# Altium schematic sheet CAN Termination Connector.SchDoc
size A4
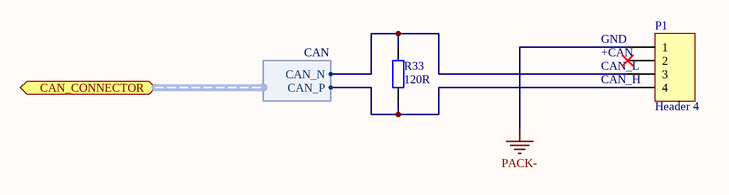
[diagram p0: CAN Termination Connector.SchDoc]

## Parts
P1  Header 4  [S04B-PASK-2]
R33  value 120R  [R0603]  (hidden comment: Res2)

## Ports
CAN_CONNECTOR (harness CAN)

## Harnesses
CAN: CAN_N, CAN_P

## Nets
PACK-: P1.1
NetP1_3: P1.3 R33.2 ; port CAN_CONNECTOR.CAN_N
NetP1_4: P1.4 R33.1 ; port CAN_CONNECTOR.CAN_P

Not connected (* = marked no-connect by the designer): P1 2*

## Notes on the sheet
- (near P1) GND
- (near P1) +CAN
- (near P1) CAN_L
- (near P1) CAN_H

## Library data of the parts
P1 = Header 4: Header, 4-Pin; LatestRevisionDate: 17-Jul-2002; LatestRevisionNote: Re-released for DXP Platform.; Publisher: Altium Limited; farnell: 1830749
R33 = Res2: Resistor; Published: 8-Jun-2000; LatestRevisionDate: 17-Jul-2002; LatestRevisionNote: Re-released for DXP Platform.; PackageReference: AXIAL-0.4; Publisher: Altium Limited; farnell: 9330496